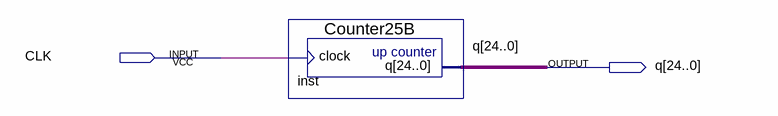
[diagram p0: schematic sheet]
// Quartus schematic Project6.bdf as structural Verilog: 1 symbols, 2 pins
module Project6 (
  input  CLK,
  output [24:0] q
);

  Counter25B inst (.clock(CLK), .q(q));
endmodule
